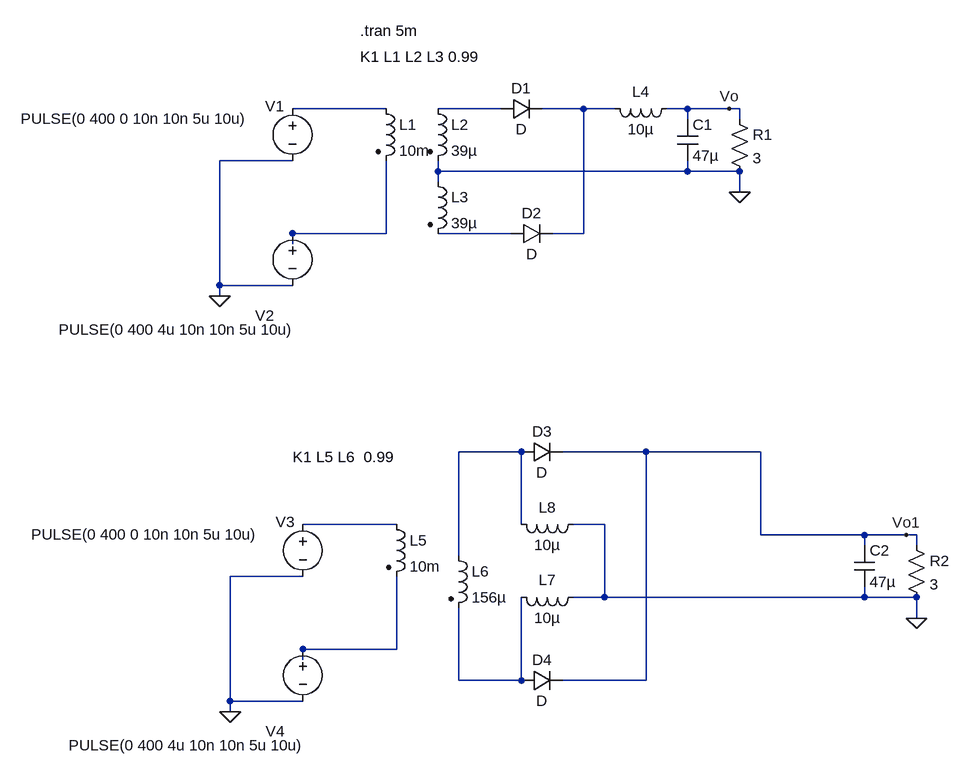
[diagram p0: schematic current_doubler.asc]
current_doubler.asc, the LTspice schematic file:
Version 4
SHEET 1 888 1092
WIRE 16 96 -128 96
WIRE 192 96 96 96
WIRE 320 96 256 96
WIRE 368 96 320 96
WIRE 480 96 448 96
WIRE 544 96 480 96
WIRE 560 96 544 96
WIRE 480 112 480 96
WIRE 560 112 560 96
WIRE -128 176 -240 176
WIRE 96 192 96 176
WIRE 480 192 480 176
WIRE 480 192 96 192
WIRE 560 192 480 192
WIRE 96 208 96 192
WIRE 560 224 560 192
WIRE 16 288 16 176
WIRE 16 288 -128 288
WIRE 208 288 96 288
WIRE 320 288 320 96
WIRE 320 288 272 288
WIRE -128 304 -128 288
WIRE -240 368 -240 176
WIRE -128 368 -240 368
WIRE -240 384 -240 368
WIRE 224 624 128 624
WIRE 416 624 288 624
WIRE 592 624 416 624
WIRE 32 736 -112 736
WIRE 224 736 224 624
WIRE 352 736 304 736
WIRE 592 752 592 624
WIRE 752 752 592 752
WIRE 816 752 752 752
WIRE 832 752 816 752
WIRE 752 768 752 752
WIRE 832 768 832 752
WIRE 128 784 128 624
WIRE -112 816 -224 816
WIRE 352 848 352 736
WIRE 352 848 304 848
WIRE 752 848 752 832
WIRE 752 848 352 848
WIRE 832 848 752 848
WIRE 832 880 832 848
WIRE 32 928 32 816
WIRE 32 928 -112 928
WIRE -112 944 -112 928
WIRE 128 976 128 864
WIRE 224 976 224 848
WIRE 224 976 128 976
WIRE 416 976 416 624
WIRE 416 976 288 976
WIRE -224 1008 -224 816
WIRE -112 1008 -224 1008
WIRE -224 1024 -224 1008
FLAG -240 384 0
FLAG 560 224 0
FLAG 544 96 Vo
FLAG -224 1024 0
FLAG 832 880 0
FLAG 816 752 Vo1
SYMBOL ind2 0 80 R0
SYMATTR InstName L1
SYMATTR Value 10m
SYMATTR Type ind
SYMATTR SpiceLine Rser=10m
SYMBOL ind2 80 80 R0
SYMATTR InstName L2
SYMATTR Value 39µ
SYMATTR Type ind
SYMBOL ind2 80 192 R0
SYMATTR InstName L3
SYMATTR Value 39µ
SYMATTR Type ind
SYMBOL voltage -128 80 R0
WINDOW 0 -42 12 Left 2
WINDOW 3 -418 31 Left 2
WINDOW 123 0 0 Left 0
WINDOW 39 0 0 Left 0
SYMATTR InstName V1
SYMATTR Value PULSE(0 400 0 10n 10n 5u 10u)
SYMBOL voltage -128 272 R0
WINDOW 0 -57 142 Left 2
WINDOW 3 -360 164 Left 2
WINDOW 123 0 0 Left 0
WINDOW 39 0 0 Left 0
SYMATTR InstName V2
SYMATTR Value PULSE(0 400 4u 10n 10n 5u 10u)
SYMBOL res 544 96 R0
SYMATTR InstName R1
SYMATTR Value 3
SYMBOL diode 192 112 R270
WINDOW 0 32 32 VTop 2
WINDOW 3 0 32 VBottom 2
SYMATTR InstName D1
SYMBOL diode 208 304 R270
WINDOW 0 32 32 VTop 2
WINDOW 3 0 32 VBottom 2
SYMATTR InstName D2
SYMBOL cap 464 112 R0
SYMATTR InstName C1
SYMATTR Value 47µ
SYMBOL ind 352 80 M90
WINDOW 0 5 56 VBottom 2
WINDOW 3 32 56 VTop 2
SYMATTR InstName L4
SYMATTR Value 10µ
SYMBOL ind2 16 720 R0
SYMATTR InstName L5
SYMATTR Value 10m
SYMATTR Type ind
SYMATTR SpiceLine Rser=10m
SYMBOL ind2 112 768 R0
SYMATTR InstName L6
SYMATTR Value 156µ
SYMATTR Type ind
SYMBOL voltage -112 720 R0
WINDOW 0 -42 12 Left 2
WINDOW 3 -418 31 Left 2
WINDOW 123 0 0 Left 0
WINDOW 39 0 0 Left 0
SYMATTR InstName V3
SYMATTR Value PULSE(0 400 0 10n 10n 5u 10u)
SYMBOL voltage -112 912 R0
WINDOW 0 -57 142 Left 2
WINDOW 3 -360 164 Left 2
WINDOW 123 0 0 Left 0
WINDOW 39 0 0 Left 0
SYMATTR InstName V4
SYMATTR Value PULSE(0 400 4u 10n 10n 5u 10u)
SYMBOL res 816 752 R0
SYMATTR InstName R2
SYMATTR Value 3
SYMBOL diode 224 640 R270
WINDOW 0 32 32 VTop 2
WINDOW 3 0 32 VBottom 2
SYMATTR InstName D3
SYMBOL diode 224 992 R270
WINDOW 0 32 32 VTop 2
WINDOW 3 0 32 VBottom 2
SYMATTR InstName D4
SYMBOL cap 736 768 R0
SYMATTR InstName C2
SYMATTR Value 47µ
SYMBOL ind 208 720 M90
WINDOW 0 5 56 VBottom 2
WINDOW 3 32 56 VTop 2
SYMATTR InstName L8
SYMATTR Value 10µ
SYMBOL ind 208 832 M90
WINDOW 0 5 56 VBottom 2
WINDOW 3 32 56 VTop 2
SYMATTR InstName L7
SYMATTR Value 10µ
TEXT -24 16 Left 2 !K1 L1 L2 L3 0.99
TEXT -24 -24 Left 2 !.tran 5m
TEXT -128 632 Left 2 !K1 L5 L6  0.99

The netlist it stands for:
* current_doubler.asc
L1 N001 N004 10m Rser=10m
L2 N002 0 39µ
L3 0 N005 39µ
V1 N001 0 PULSE(0 400 0 10n 10n 5u 10u)
V2 N004 0 PULSE(0 400 4u 10n 10n 5u 10u)
R1 Vo 0 3
D1 N002 N003 D
D2 N005 N003 D
C1 Vo 0 47µ
L4 N003 Vo 10µ
L5 N007 N008 10m Rser=10m
L6 N006 N009 156µ
V3 N007 0 PULSE(0 400 0 10n 10n 5u 10u)
V4 N008 0 PULSE(0 400 4u 10n 10n 5u 10u)
R2 Vo1 0 3
D3 N006 Vo1 D
D4 N009 Vo1 D
C2 Vo1 0 47µ
L8 N006 0 10µ
L7 N009 0 10µ
.model D D
.lib standard.dio
K1 L1 L2 L3 0.99
.tran 5m
K1 L5 L6  0.99
.backanno
.end